# EAGLE design irrigation_control_unit (EAGLE 9.6.2)
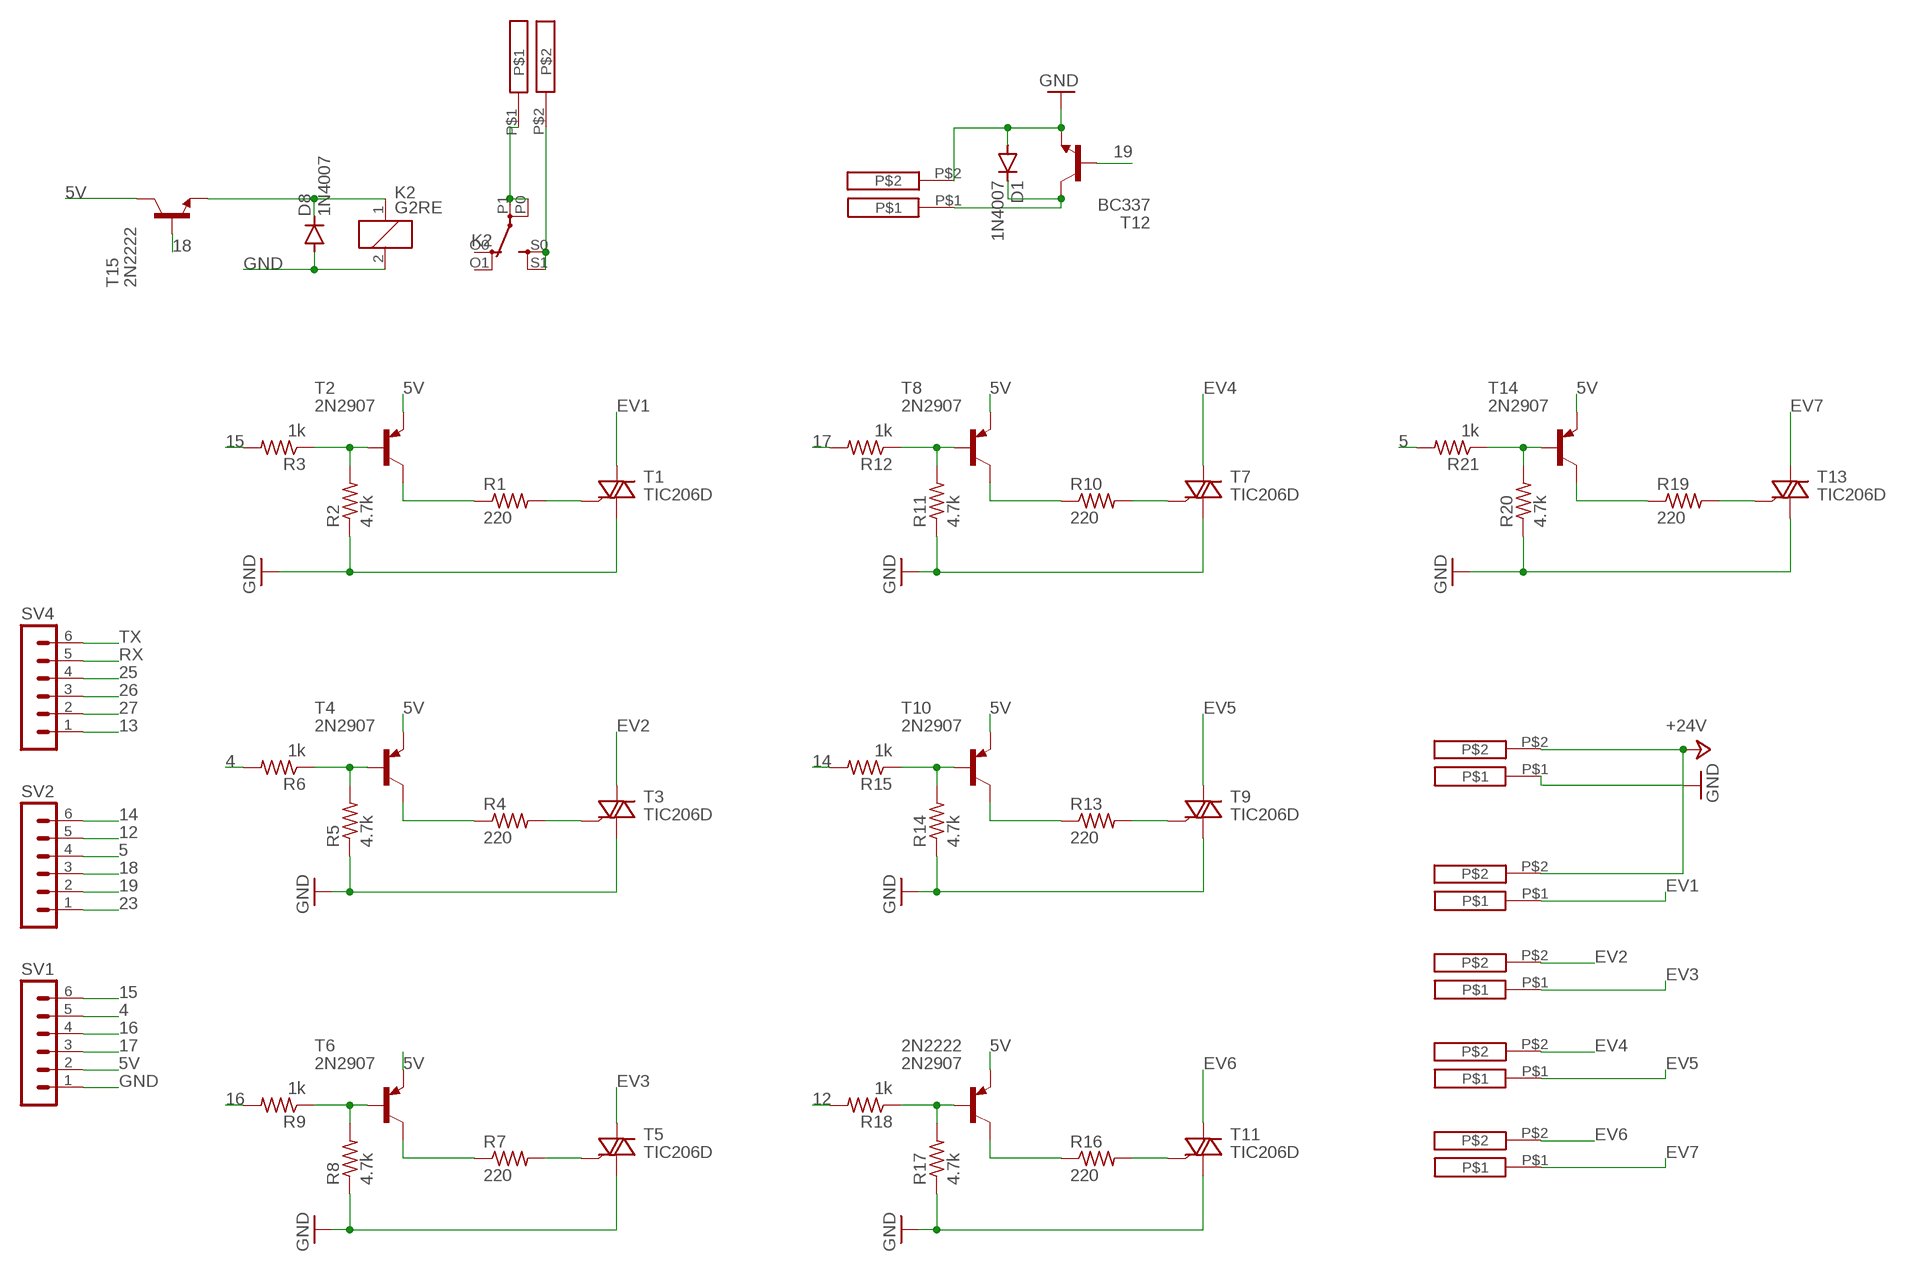
[diagram p0: schematic, sheet 1]

## Parts
2N2222  2N2907  [TO92-EBC-OVAL]
D1  1N4007  1N4148DO35-7  [DO35-7]
D8  1N4007  1N4148DO35-7  [DO35-7]
K2  G2RE  [G2RE]
R1  220  R-US_0204/7  [0204/7]
R2  4.7k  R-US_0204/7  [0204/7]
R3  1k  R-US_0204/7  [0204/7]
R4  220  R-US_0204/7  [0204/7]
R5  4.7k  R-US_0204/7  [0204/7]
R6  1k  R-US_0204/7  [0204/7]
R7  220  R-US_0204/7  [0204/7]
R8  4.7k  R-US_0204/7  [0204/7]
R9  1k  R-US_0204/7  [0204/7]
R10  220  R-US_0204/7  [0204/7]
R11  4.7k  R-US_0204/7  [0204/7]
R12  1k  R-US_0204/7  [0204/7]
R13  220  R-US_0204/7  [0204/7]
R14  4.7k  R-US_0204/7  [0204/7]
R15  1k  R-US_0204/7  [0204/7]
R16  220  R-US_0204/7  [0204/7]
R17  4.7k  R-US_0204/7  [0204/7]
R18  1k  R-US_0204/7  [0204/7]
R19  220  R-US_0204/7  [0204/7]
R20  4.7k  R-US_0204/7  [0204/7]
R21  1k  R-US_0204/7  [0204/7]
SV1  MA06-1  [MA06-1]
SV2  MA06-1  [MA06-1]
SV4  MA06-1  [MA06-1]
T1  TIC206D  [TO220BV]
T2  2N2907  [TO92-EBC-OVAL]
T3  TIC206D  [TO220BV]
T4  2N2907  [TO92-EBC-OVAL]
T5  TIC206D  [TO220BV]
T6  2N2907  [TO92-EBC-OVAL]
T7  TIC206D  [TO220BV]
T8  2N2907  [TO92-EBC-OVAL]
T9  TIC206D  [TO220BV]
T10  2N2907  [TO92-EBC-OVAL]
T11  TIC206D  [TO220BV]
T12  BC337  [TO92]
T13  TIC206D  [TO220BV]
T14  2N2907  [TO92-EBC-OVAL]
T15  2N2222  [TO92-EBC-OVAL]
U$1  2-PIN-7.5-CONNECTOR  [2-PIN-7.5-CONNECTOR]
U$2  2-PIN-7.5-CONNECTOR  [2-PIN-7.5-CONNECTOR]
U$3  2-PIN-7.5-CONNECTOR  [2-PIN-7.5-CONNECTOR]
U$4  2-PIN-7.5-CONNECTOR  [2-PIN-7.5-CONNECTOR]
U$5  2-PIN-7.5-CONNECTOR  [2-PIN-7.5-CONNECTOR]
U$6  2-PIN-7.5-CONNECTOR  [2-PIN-7.5-CONNECTOR]
U$7  2-PIN-7.5-CONNECTOR  [2-PIN-7.5-CONNECTOR]

## Nets
4: R6.2 SV1.5
5: R21.2 SV2.4
5V: 2N2222.E SV1.2 T2.E T4.E T6.E T8.E T10.E T14.E T15.C
12: R18.2 SV2.5
13: SV4.1
14: R15.2 SV2.6
15: R3.2 SV1.6
16: R9.2 SV1.4
17: R12.2 SV1.3
18: SV2.3 T15.B
19: SV2.2 T12.2(B)
23: SV2.1
25: SV4.4
26: SV4.3
27: SV4.2
+24V: U$1.P$2 U$2.P$2
EV1: T1.T2(A2) U$2.P$1
EV2: T3.T2(A2) U$3.P$2
EV3: T5.T2(A2) U$3.P$1
EV4: T7.T2(A2) U$4.P$2
EV5: T9.T2(A2) U$4.P$1
EV6: T11.T2(A2) U$5.P$2
EV7: T13.T2(A2) U$5.P$1
GND: D1.A D8.A K2.2 R2.1 R5.1 R8.1 R11.1 R14.1 R17.1 R20.1 SV1.1 T1.T1(A1) T3.T1(A1) T5.T1(A1) T7.T1(A1) T9.T1(A1) T11.T1(A1) T12.1(E) T13.T1(A1) U$1.P$1 U$7.P$2
N$1: D8.C K2.1 T15.E
N$2: R1.2 T1.G
N$3: R1.1 T2.C
N$4: D1.C T12.3(C) U$7.P$1
N$5: R2.2 R3.1 T2.B
N$6: K2.P0(2:P) K2.P1(2:P) U$6.P$1
N$7: K2.S0(2:S) K2.S1(2:S) U$6.P$2
N$8: R4.2 T3.G
N$10: R4.1 T4.C
N$12: R5.2 R6.1 T4.B
N$15: R7.2 T5.G
N$16: R7.1 T6.C
N$18: R8.2 R9.1 T6.B
N$21: R10.2 T7.G
N$22: R10.1 T8.C
N$24: R11.2 R12.1 T8.B
N$27: R13.2 T9.G
N$28: R13.1 T10.C
N$30: R14.2 R15.1 T10.B
N$33: R16.2 T11.G
N$34: 2N2222.C R16.1
N$36: 2N2222.B R17.2 R18.1
N$39: R19.2 T13.G
N$40: R19.1 T14.C
N$42: R20.2 R21.1 T14.B
RX: SV4.5
TX: SV4.6
Unconnected: K2.O0(2:O) K2.O1(2:O)

## Library data of the parts
2N2222 T2 T4 T6 T8 T10 T14 = adafruit:2N2907*: PNP Transistor Big Oval pads
D1 D8 = diode:1N4148: DIODE high speed (Philips)
K2 = relay:G2RE: RELAY 1 x switch, high current, Omron; OC_FARNELL: unknown; OC_NEWARK: unknown
R1-R21 = adafruit:R-US_: RESISTOR, American symbol
SV1 SV2 SV4 = con-lstb:MA06-1: PIN HEADER; OC_FARNELL: unknown; OC_NEWARK: unknown
T1 T3 T5 T7 T9 T11 T13 = triac:TIC206: TRIAC Source: http://www.bourns.com/pdfs/tic206.pdf
T12 = transistor:BC337: NPN TRANSISTOR
T15 = adafruit:2N2222: NPN TRANSISTOR Big oval pads
U$1-U$7 = connectors:2-PIN-7.5-CONNECTOR

## Net classes
0 default: width 0.406 mm

## Board
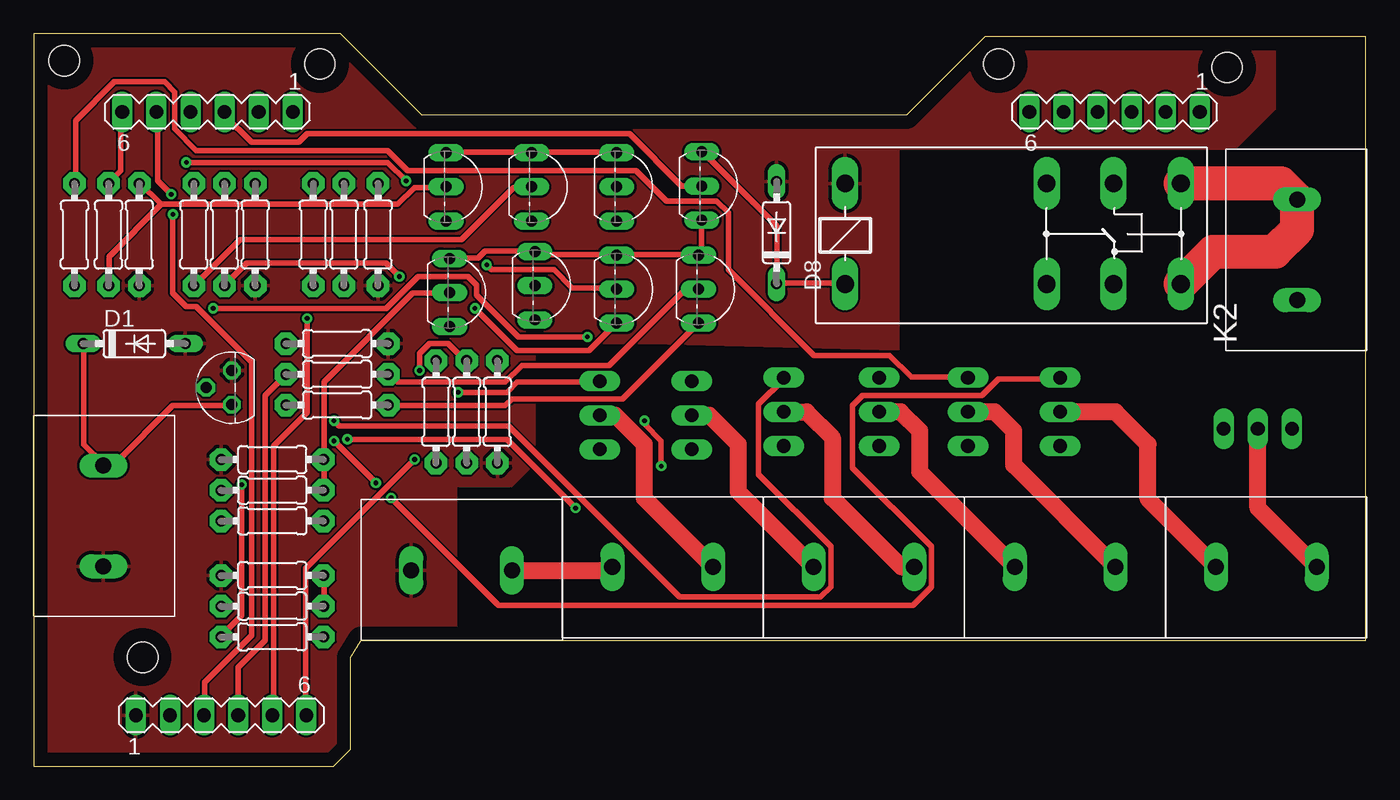
[diagram p1: board, top side]
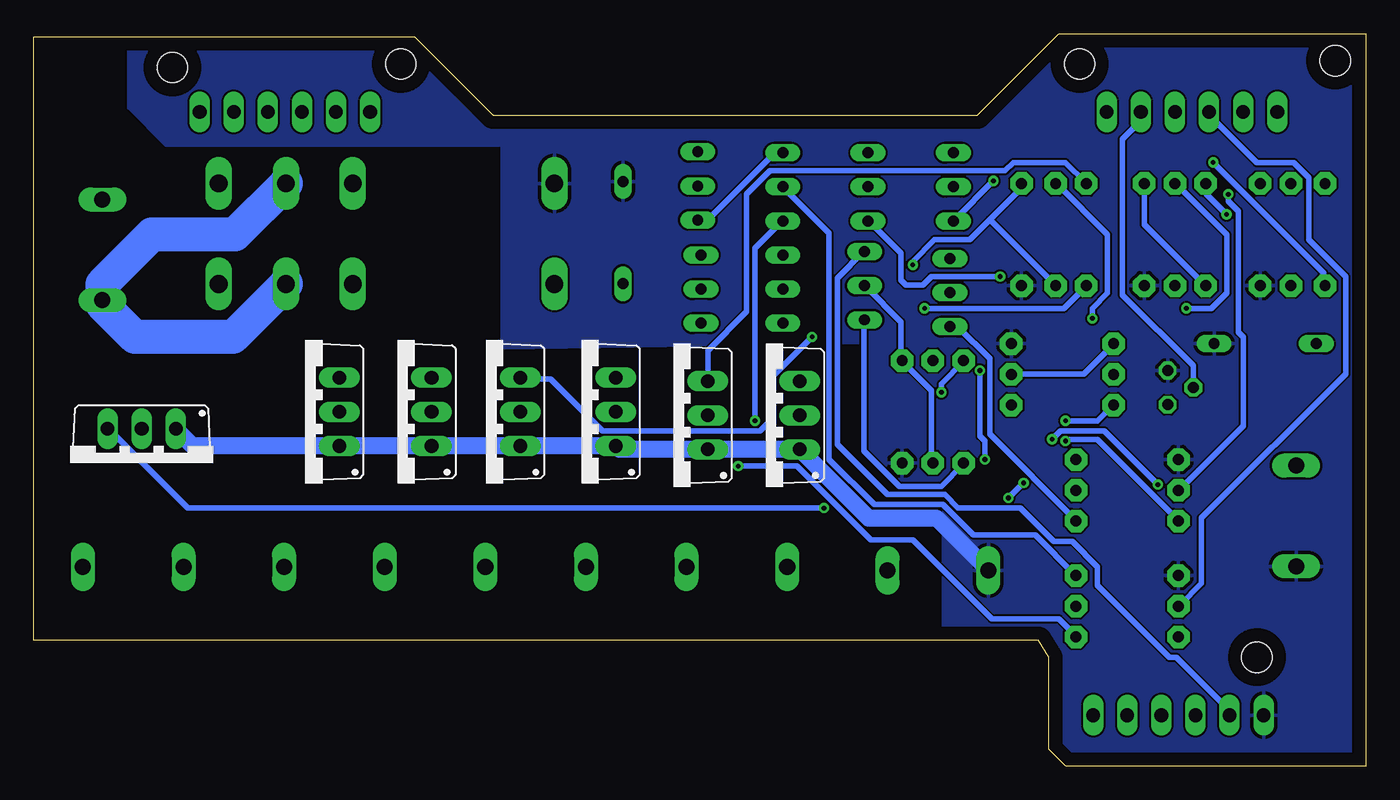
[diagram p2: board, bottom side, seen from below]

Size 99.24 x 54.6 mm. Coordinates in mm from the lower left corner, seen from the top.
Outline: 0,0 22.35,0 23.62,1.27 23.62,8.13 24.38,9.4 99.24,9.4 99.24,54.35 70.87,54.36 65.02,48.51 28.96,48.51 22.87,54.6 0,54.6 0,0
Copper layers (1*16): Top 0.035mm / dielectric 1.5mm / Bottom 0.035mm
Design rules "default": minimum track width 6mil, minimum drill 0.35mm, track to track 6mil, track to pad 6mil, pad to pad 6mil, via to via 6mil, smd to smd 6mil, copper to edge 40mil, drill to drill 6mil, minimum pad ring 10mil, minimum via ring 8mil, stop-mask expansion 4mil, vias tented up to drill 0mil, thermal gap 10mil
Holes 2.25 mm at 88.9,52.07 71.88,52.32 21.34,52.32 2.29,52.58 8.13,8.13

### Footprints (pad centres in the part's own frame; a part is rotated, then mirrored left to right if it is on the bottom)
TO92-EBC-OVAL = drill 0.813 long: B 0,-1.27; C 2.54,-1.27; E -2.54,-1.27
DO35-7 = drill 0.813 long: A 3.81,0; C -3.81,0
G2RE = drill 1.321 long: 1 -2.54,-3.683; 2 -2.54,3.81; O0 12.471,-3.683; O1 12.471,3.81; P0 17.45,-3.683; P1 17.45,3.81; S0 22.454,-3.683; S1 22.454,3.81
0204/7 = drill 0.813 pad 1.676 octagon: 1 -3.81,0; 2 3.81,0
MA06-1 = drill 1.016 long: 1 -6.35,0; 2 -3.81,0; 3 -1.27,0; 4 1.27,0; 5 3.81,0; 6 6.35,0
TO220BV = drill 1.016 long: G 2.54,-2.54; T1 -2.54,-2.54; T2 0,-2.54
TO92 = drill 0.813 octagon: 1 1.27,0; 2 0,1.905; 3 -1.27,0
2-PIN-7.5-CONNECTOR = drill 1.2 long: P$1 3.75,5.2; P$2 11.25,5.2

### Placement (x,y rotation side)
2N2222  32.26,35.31 270 top
D1  7.5,31.5 0 top
D8  55.35,39.77 90 top
K2  62.99,39.62 0 top
R1  29.97,26.42 90 top
R2  34.54,26.42 90 top
R3  32.26,26.42 90 top
R4  20.83,39.62 90 top
R5  25.65,39.62 90 top
R6  23.11,39.62 90 top
R7  22.61,26.92 180 top
R8  22.61,31.5 180 top
R9  22.61,29.21 180 top
R10  14.22,39.62 90 top
R11  16.51,39.62 90 top
R12  11.94,39.62 90 top
R13  3.05,39.62 90 top
R14  7.87,39.62 90 top
R15  5.59,39.62 90 top
R16  17.78,18.29 180 top
R17  17.78,22.86 0 top
R18  17.78,20.57 180 top
R19  17.78,9.65 180 top
R20  17.78,14.22 0 top
R21  17.78,11.94 180 top
SV1  13.97,3.81 0 top
SV2  12.95,48.77 180 top
SV4  80.52,48.77 180 top
T1  44.7,26.16 90 bottom
T2  38.61,35.81 270 top
T3  51.56,26.16 90 bottom
T4  44.7,35.56 270 top
T5  58.42,26.42 90 bottom
T6  50.8,35.56 270 top
T7  65.53,26.42 90 bottom
T8  38.35,43.18 270 top
T9  72.14,26.42 90 bottom
T10  32,43.18 270 top
T11  78.99,26.42 90 bottom
T12  14.77,28.22 90 top
T13  91.19,22.61 180 bottom
T14  44.7,43.18 270 top
T15  51.04,43.25 270 top
U$1  24.38,9.4 0 top
U$2  54.36,20.07 180 top
U$3  69.34,20.07 180 top
U$4  84.33,20.07 180 top
U$5  99.31,20.07 180 top
U$6  99.31,30.99 90 top
U$7  0,26.16 270 top

### Tracks (layer width: path | path; a pad name or v marks a point on that pad's centre or on a via)
4  (via drill 0.35)
  Top 0.406: v20.38,33.38 20.38,26.38 17.88,23.88 17.88,3.88 SV1.5
  Bottom 0.406: v20.38,33.38 20.38,34.12 19.25,35.25 19.25,39.62 23,43.38 R6.2
5
  Bottom 0.406: SV2.4 11.62,48.75 11.62,48.5 8.12,45 5.38,45 4.25,43.88 4.25,39.25 1.5,36.5 1.5,29.25 12.25,18.5 12.25,13.62 13.88,12 R21.2
5V
  Top 0.406: T10.E 30.75,45.75 37,45.75 T8.E 37.25,45.75 43.38,45.75 T14.E | T15.C 49.75,40.62 49.75,38.38 49.62,38.25 T6.E 49.5,38.12 43.5,38.12 T4.E 43.25,38.12 37.62,38.12 37.5,38.25 T2.E 37.25,38.38 33.62,38.38 33.12,37.88 31,37.88 2N2222.E
  Bottom 0.406: SV1.2 10.25,3.88 10.25,4.25 14.12,8.12 14.62,8.12 20,13.5 20,14.88 21.88,16.75 23.25,16.75 25.75,19.25 30.38,19.25 31.38,20.25 35.62,20.25 39.38,24 39.38,36.38 37.38,38.38 T2.E | T14.E 43.5,45.62 44.12,45.62 49,40.75 49.75,40.75 T15.C
12  (via drill 0.35)
  Top 0.406: v10.25,42.62 9.25,43.62 9.25,48.75 SV2.5
  Bottom 0.406: v10.25,42.62 10.25,42.12 9.5,41.38 9.5,32.38 9.12,32 9.12,25.38 13.88,20.62 R18.2
14
  Top 0.406: SV2.6 6.5,48.75 6.5,44.38 5.62,43.5 R15.2
15  (via drill 0.35)
  Top 0.406: v28.38,22.88 20.25,14.75 20.25,3.88 SV1.6 | v28.75,29.5 28.75,30.75 29.5,31.5 30.88,31.5 32.25,30.12 R3.2
  Bottom 0.406: v28.38,22.88 28.38,24.25 28.75,24.62 v28.75,29.5
16
  Top 0.406: SV1.4 15.25,3.88 15.25,7.38 17.25,9.38 17.25,27.62 18.75,29.12 R9.2
17  (via drill 0.35)
  Top 0.406: v10.38,41.12 10.38,35.25 11.38,34.25 12.12,34.25 16.25,30.12 16.25,9.75 12.75,6.25 12.75,3.88 SV1.3
  Bottom 0.406: v10.38,41.12 11.88,42.62 11.88,43.38 R12.2
18
  Top 0.406: T15.B 49.75,43.25 48.25,43.25 44.38,47.12 20.38,47.12 19.75,46.5 16.25,46.5 14.25,48.5 14.25,48.75 SV2.3
19
  Bottom 0.406: T12.2 12.88,28.25 12.88,29.88 18.12,35.12 18.12,46.75 16.88,48 16.88,48.75 SV2.2
+24V
  Top 1.27: U$1.P$2 43.09,14.6 43.09,14.85 U$2.P$2
EV1
  Top 1.27: U$2.P$1 45.5,19.97 45.5,24 43.34,26.16 T1.T2
EV2
  Top 1.27: U$3.P$2 52.5,20.46 52.5,24 50.34,26.16 T3.T2
EV3
  Top 1.27: T5.T2 57.58,26.42 59.5,24.5 59.5,20 64.63,14.87 U$3.P$1
EV4
  Top 1.27: U$4.P$2 66,21.94 66,25 64.58,26.42 T7.T2
EV5
  Top 1.27: U$4.P$1 73,22.44 73,25 71.58,26.42 T9.T2
EV6
  Top 1.27: U$5.P$2 83,19.93 83,24 80.58,26.42 T11.T2
EV7
  Top 1.27: U$5.P$1 91.19,19.24 T13.T2
GND
  Bottom 1.27: U$1.P$1 28.13,14.63 32,18.5 37.04,18.5 T1.T1 T3.T1 55.63,23.62 T5.T1 T7.T1 T9.T1 T11.T1 87.38,23.88 T13.T1
  pour Bottom: 31.5,6.35 31.5,20.95 35.68,20.95 37.34,22.61 37.34,31.5 64.37,31.11 64.37,46.23 89.41,46.23 92.2,49.02 92.2,57.15 92.46,57.4 -4.32,57.4 -4.57,57.15 -4.57,-2.03 23.11,-2.03
  pour Top: 31.51,4.33 31.51,20.9 35.64,20.9 37.34,22.61 37.34,31.5 45.76,31.53 64.46,31.06 64.46,46.01 66.49,46.01 66.5,46 89.51,46.01 92.5,49 92.5,57.5 -4.5,57.5 -4.5,0 -2,-2.5 24.68,-2.5
N$1
  Top 0.406: K2.1 60.38,36 55.38,36 D8.C 55.38,36.12 55.38,40.25 49.88,45.75 T15.E
N$2  (via drill 0.35)
  Top 0.406: v31.62,27.88 35.25,27.88 36,28.62 42.12,28.62 T1.G
  Bottom 0.406: v31.62,27.88 31.62,28.5 30,30.12 R1.2
N$3
  Bottom 0.406: T2.C 37.38,33.25 37.38,23.5 34.75,20.88 31.62,20.88 30,22.5 R1.1
N$4
  Top 0.406: D1.C 3.75,31.5 3.75,24 5.25,22.5 U$7.P$1 5.38,22.62 6.12,22.62 10.38,26.88 14.75,26.88 T12.3
N$5
  Bottom 0.406: T2.B 37.25,35.75 34.62,33.12 34.62,30.25 R2.2 34.5,30.12 32.38,28 32.38,22.62 R3.1
N$6
  Bottom 2.54: K2.P1 84.25,39.62 90.42,39.62 94.11,35.93 U$6.P$1 94.11,34.42 91.69,32 84.38,32 K2.P0
N$7
  Top 2.54: K2.S1 92.92,43.43 U$6.P$2 94.11,40.01 92.46,38.35 87.86,38.35 K2.S0
N$8
  Bottom 0.406: T3.G 49,28.75 49,31 46.12,33.88 46.12,42.62 44.38,44.38 26.88,44.38 26.25,45 22.38,45 20.88,43.5 R4.2
N$10  (via drill 0.35)
  Top 0.406: v32.88,34.12 36,31 41.38,31 43.38,33 T4.C
  Bottom 0.406: v32.88,34.12 22.5,34.12 20.88,35.75 R4.1
N$12  (via drill 0.35)
  Top 0.406: v33.75,37.38 34.12,37 38.75,37 40.12,35.62 43.38,35.62 T4.B
  Bottom 0.406: v33.75,37.38 33.75,37.62 32.12,39.25 29.5,39.25 28,40.75 | 28,40.75 25.75,43 25.75,43.38 R5.2 | 28,40.75 23.12,35.88 R6.1
N$15  (via drill 0.35)
  Top 0.406: v22.38,25.75 22.75,25.38 35.38,25.38 48.12,12.62 58.62,12.62 59.38,13.38 59.38,16.38 54,21.75 54,27 55.88,28.88 T5.G
  Bottom 0.406: v22.38,25.75 20,25.75 18.88,26.88 R7.2
N$16
  Top 0.406: T6.C 49.5,33 43.88,27.38 35.62,27.38 35.12,26.88 26.5,26.88 R7.1
N$18
  Top 0.406: T6.B 49.5,35.5 48.5,35.5 42.88,29.88 36.38,29.88 35.12,28.62 27.12,28.62 26.5,29.25 R9.1
  Bottom 0.406: R8.2 18.88,31.38 21,29.25 26.38,29.25 R9.1
N$21  (via drill 0.35)
  Top 0.406: v41.25,32 36.12,32 33,35.12 33,35.88 32.38,36.5 28.62,36.5 26.25,34.12 v13.38,34.12
  Bottom 0.406: v41.25,32 44.12,29.12 44.12,26 45.12,25 56.88,25 60.75,28.88 62.88,28.88 T7.G | v13.38,34.12 11.5,34.12 10.38,35.25 10.38,39.62 14.12,43.38 R10.2
N$22  (via drill 0.35)
  Top 0.406: v27.25,36.5 26.25,37.5 15.88,37.5 14.25,35.88 R10.1
  Bottom 0.406: v27.25,36.5 32.38,36.5 33,35.88 34.25,35.88 34.62,36.25 34.62,38.25 37,40.62 T8.C
N$24
  Top 0.406: T8.B 37,43.12 35.75,43.12 31.88,39.25 15.38,39.25 12,35.88 R12.1
  Bottom 0.406: R11.2 16.5,43.38 16.5,40.38 12,35.88 R12.1
N$27
  Top 0.406: T9.G 69.5,29 65.38,29 63.75,30.62 58.12,30.62 51.75,37 51.75,41.25 50.88,42.12 47.12,42.12 44.88,44.38 27.88,44.38 26.38,45.88 12.12,45.88 10.5,47.5 10.5,50.25 9.75,51 6,51 3.12,48.12 3.12,43.5 R13.2
N$28  (via drill 0.35)
  Top 0.406: v27.75,43.62 26.38,45 v11.38,45
  Bottom 0.406: v27.75,43.62 30.62,40.75 T10.C | v11.38,45 3.12,36.75 3.12,35.88 R13.1
N$30
  Top 0.406: 9.5,41.88 27.12,41.88 28.38,43.12 30.62,43.12 T10.B | 9.5,41.88 7.88,43.5 R14.2 | 9.5,41.88 5.62,38 5.62,35.88 R15.1
N$33  (via drill 0.35)
  Top 0.406: v26.62,20 34.62,12 65.5,12 66.88,13.38 66.88,16.38 61,22.25 61,26.88 61.75,27.62 70.62,27.62 71.88,28.88 76.38,28.88 T11.G | v22.38,24.25 v25.5,21.12
  Bottom 0.406: v25.5,21.12 v26.62,20 | v22.38,24.25 22.25,24.38 20,24.38 14,18.38 R16.2
N$34
  Bottom 0.406: 2N2222.C 30.88,32.75 30.38,32.75 28,30.38 28,24.75 21.62,18.38 R16.1
N$36
  Top 0.406: 2N2222.B 30.88,35.25 28.25,35.25 21.62,28.62 21.62,22.88 R17.2 21.62,22.75 21.62,20.62 R18.1
N$39  (via drill 0.35)
  Top 0.406: v40.38,19.25 35.25,24.38 v23.38,24.38 | v15.5,21 15.5,11.25 14,9.75 R19.2
  Bottom 0.406: v40.38,19.25 87.75,19.25 93.62,25.12 T13.G | v23.38,24.38 22.75,25 19.5,25 v15.5,21
N$40  (via drill 0.35)
  Top 0.406: v45.5,25.75 45.5,25.5 46.75,24.25 v46.75,22.38
  Bottom 0.406: v45.5,25.75 45.5,38.62 43.5,40.62 T14.C | v46.75,22.38 42.38,22.38 36.88,16.88 33.75,16.88 27.88,11 22.88,11 21.62,9.75 R19.1
N$42
  Top 0.406: R21.1 21.62,12 21.62,14.12 R20.2
  Bottom 0.406: T14.B 43.38,43.12 40,39.75 40,22.88 36.62,19.5 31.5,19.5 29.25,17.25 24.62,17.25 21.62,14.25 R20.2

### Text on the board
tTest: JLCJLCJLCJLC | GND | EV1 | EV2 | EV3 | EV4 | EV5 | EV6 | EV7
bTest: 14 | 12 | 5 | 18 | 19 | TX | RX | 25 | 26 | 27 | 23 | 13 | Il garage del Bicchio | irrigation_v1 | +24VAC | gnd | 5v | 17 | 16 | 4 | 15